# Altium schematic sheet Main.SchDoc: MAIN
size A3; Author: Marius; Engineer: Marius; Address1: ETS
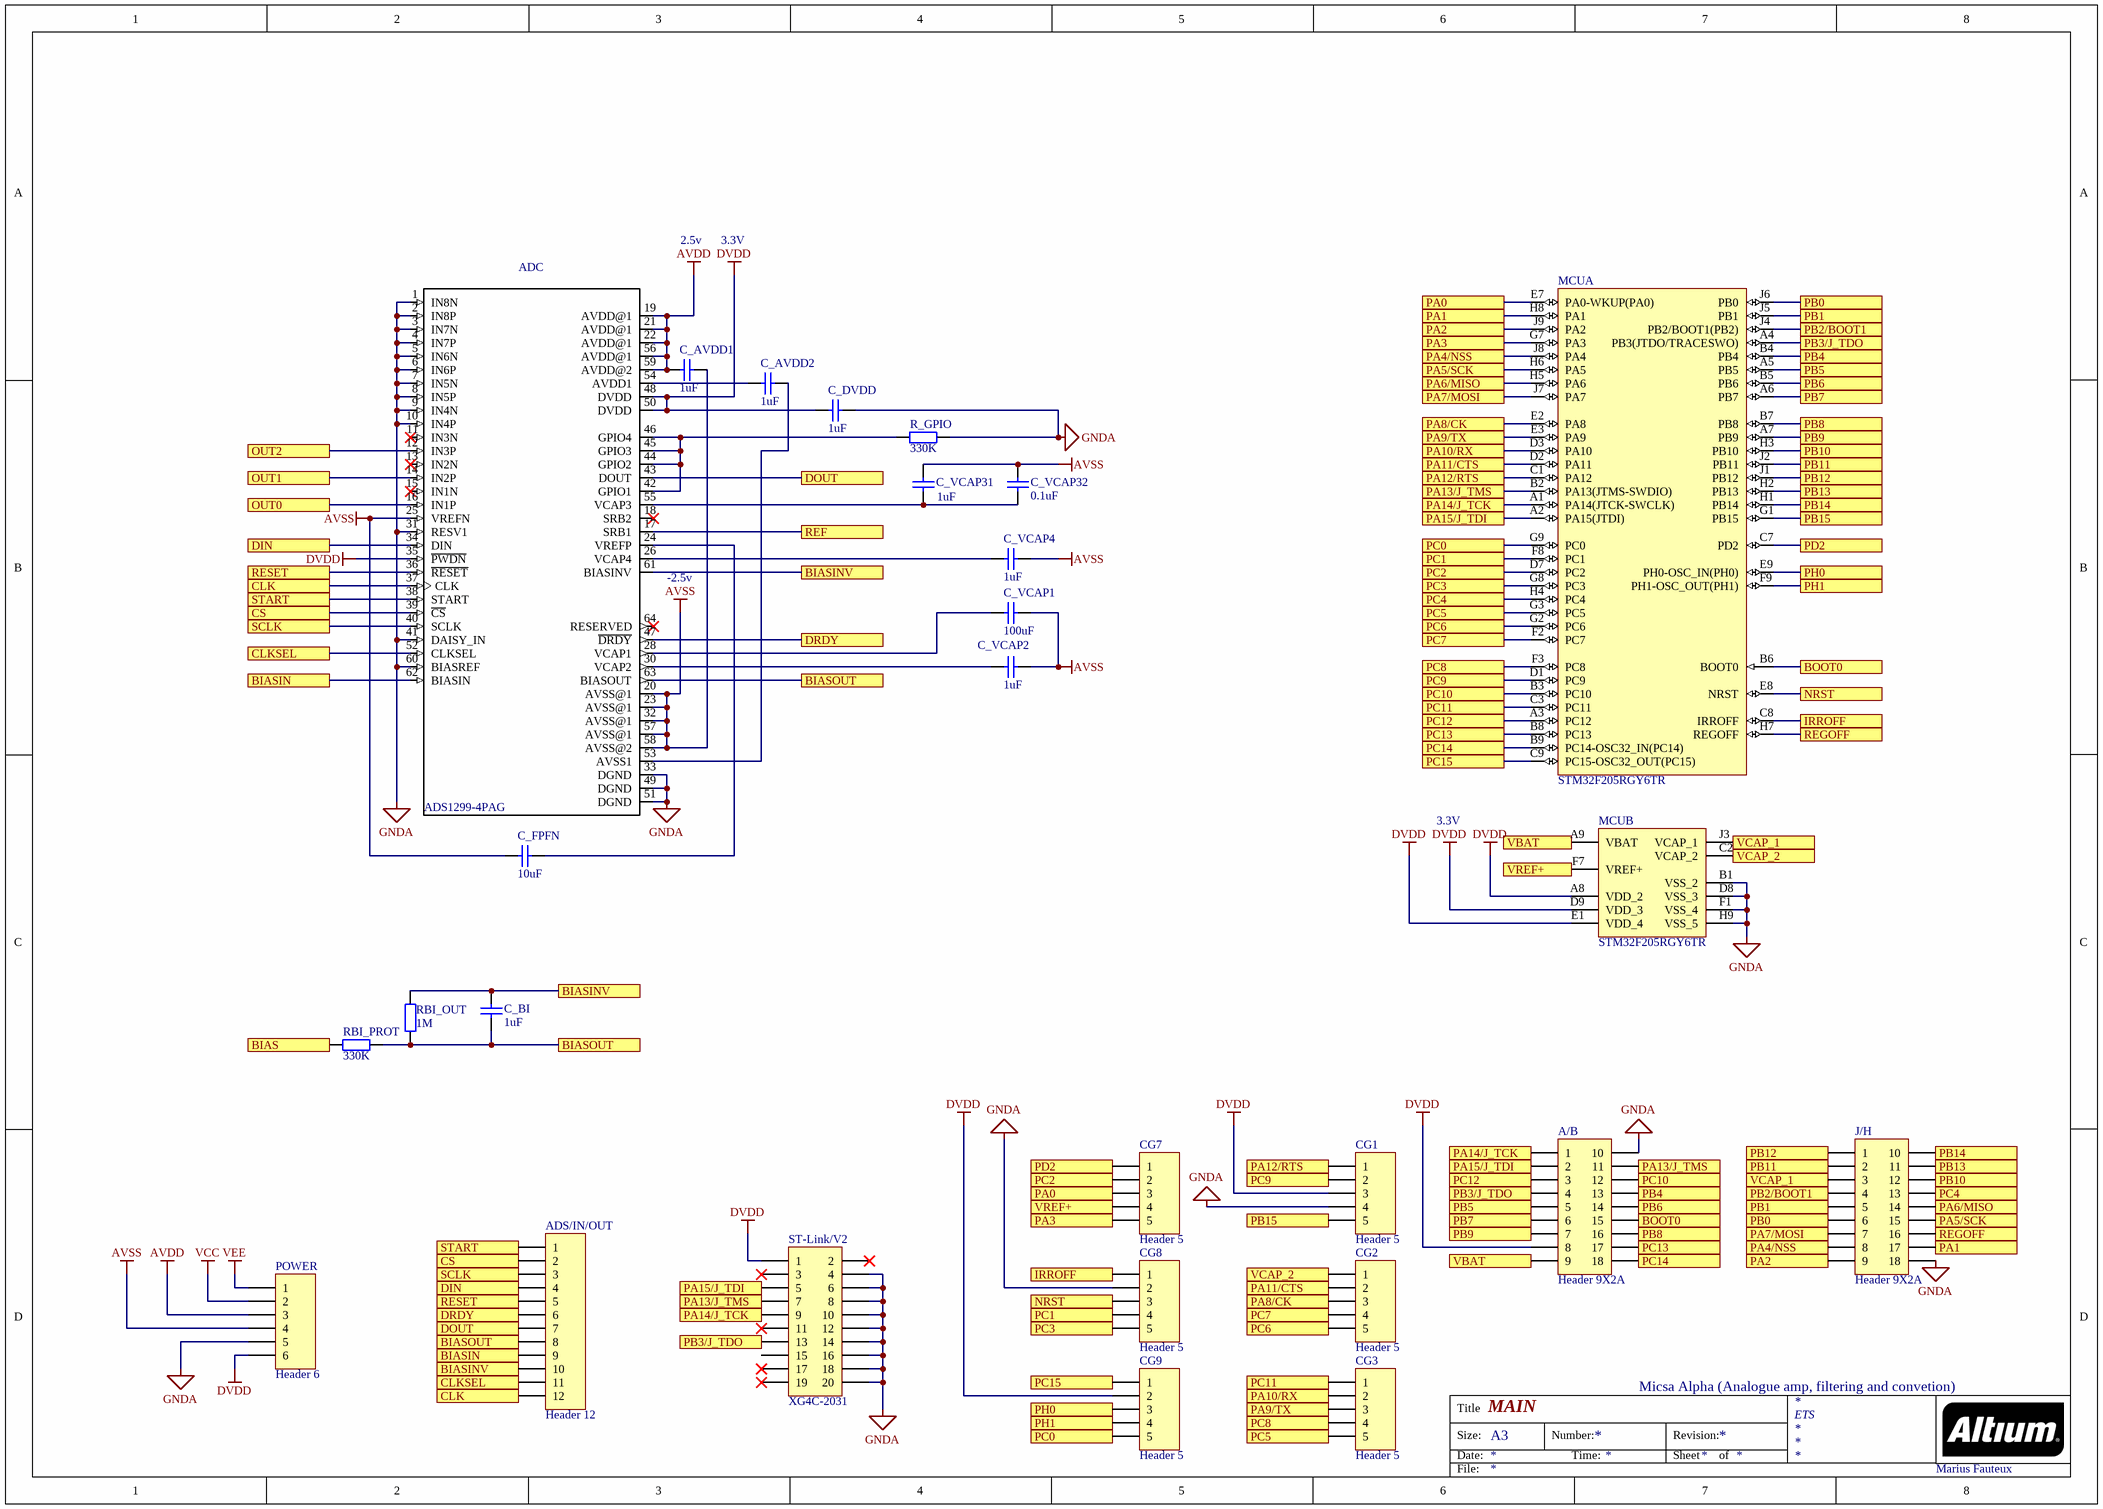
[diagram p0: Main.SchDoc]

## Parts
A/B  Header 9X2A  [HDR2X9_CEN]
ADC  ADS1299-4PAG  [QFP64P50_1200X1200X120L60X22N]
ADS/IN/OUT  Header 12  [HDR1X12]
C_AVDD1  value 1uF  [0603 (1608 Metric)]  (hidden comment: LMK107B7105KA-T)
C_AVDD2  value 1uF  [0603 (1608 Metric)]  (hidden comment: LMK107B7105KA-T)
C_BI  value 1uF  [0603 (1608 Metric)]  (hidden comment: LMK107B7105KA-T)
C_DVDD  value 1uF  [0603 (1608 Metric)]  (hidden comment: LMK107B7105KA-T)
C_FPFN  value 10uF  [1206 (3216 Metric)]  (hidden comment: C1206C106J8RACTU)
C_VCAP1  value 100uF  [1210 (3225 Metric)]  (hidden comment: JMK325BJ107MM-T)
C_VCAP2  value 1uF  [0603 (1608 Metric)]  (hidden comment: LMK107B7105KA-T)
C_VCAP4  value 1uF  [0603 (1608 Metric)]  (hidden comment: LMK107B7105KA-T)
C_VCAP31  value 1uF  [0603 (1608 Metric)]  (hidden comment: LMK107B7105KA-T)
C_VCAP32  value 0.1uF  [1206 (3216 Metric)]  (hidden comment: C1206C104F3GACTU)
CG1  Header 5  [HDR1X5]
CG2  Header 5  [HDR1X5]
CG3  Header 5  [HDR1X5]
CG7  Header 5  [HDR1X5]
CG8  Header 5  [HDR1X5]
CG9  Header 5  [HDR1X5]
J/H  Header 9X2A  [HDR2X9_CEN]
MCU  STM32F205RGY6TR  [STM-WLCSP64+2]  (parts A,B of 2)
POWER  Header 6  [HDR1X6]
R_GPIO  value 330K  [1206 (3216 Metric) RES]  (hidden comment: RT1206BRD07330KL)
RBI_OUT  value 1M  [1206 (3216 Metric) RES]  (hidden comment: RG3216P-1004-B-T1)
RBI_PROT  value 330K  [1206 (3216 Metric) RES]  (hidden comment: RT1206BRD07330KL)
ST-Link/V2  XG4C-2031  [HDR2X10]

## Ports
BIAS, BIASIN, BIASINV, BIASOUT, BOOT0, CLK, CLKSEL, CS, DIN, DOUT, DRDY, IRROFF, NRST, OUT0, OUT1, OUT2, PA0, PA1, PA2, PA3, PA4/NSS, PA5/SCK, PA6/MISO, PA7/MOSI, PA8/CK, PA9/TX, PA10/RX, PA11/CTS, PA12/RTS, PA13/J_TMS, PA14/J_TCK, PA15/J_TDI, PB0, PB1, PB2/BOOT1, PB3/J_TDO, PB4, PB5, PB6, PB7, PB8, PB9, PB10, PB11, PB12, PB13, PB14, PB15, PC0, PC1, PC2, PC3, PC4, PC5, PC6, PC7, PC8, PC9, PC10, PC11, PC12, PC13, PC14, PC15, PD2, PH0, PH1, REF, REGOFF, RESET, SCLK, START, VBAT, VCAP_1, VCAP_2, VREF+

## Nets
AVDD: ADC.19(AVDD@1) ADC.21(AVDD@1) ADC.22(AVDD@1) ADC.56(AVDD@1) ADC.59(AVDD@2) C_AVDD1.1 POWER.3
AVSS: ADC.20(AVSS@1) ADC.23(AVSS@1) ADC.25(VREFN) ADC.32(AVSS@1) ADC.57(AVSS@1) ADC.58(AVSS@2) C_AVDD1.2 C_FPFN.2 C_VCAP1.1 C_VCAP2.1 C_VCAP4.2 C_VCAP31.1 C_VCAP32.1 POWER.4
DVDD: A/B.8 ADC.35(~{PWDN}) ADC.48(DVDD) ADC.50(DVDD) C_DVDD.1 CG1.3 CG9.2 MCU.A8(VDD_2) MCU.D9(VDD_3) MCU.E1(VDD_4) POWER.6 ST-Link/V2.1
GNDA: A/B.10 ADC.1(IN8N) ADC.2(IN8P) ADC.3(IN7N) ADC.4(IN7P) ADC.5(IN6N) ADC.6(IN6P) ADC.7(IN5N) ADC.8(IN5P) ADC.9(IN4N) ADC.10(IN4P) ADC.31(RESV1) ADC.33(DGND) ADC.41(DAISY_IN) ADC.49(DGND) ADC.51(DGND) ADC.60(BIASREF) C_DVDD.2 CG1.4 CG8.2 J/H.18 MCU.B1(VSS_2) MCU.D8(VSS_3) MCU.F1(VSS_4) MCU.H9(VSS_5) POWER.5 R_GPIO.1 ST-Link/V2.4 ST-Link/V2.6 ST-Link/V2.8 ST-Link/V2.10 ST-Link/V2.12 ST-Link/V2.14 ST-Link/V2.16 ST-Link/V2.18 ST-Link/V2.20
VCC: POWER.2
VEE: POWER.1
BIAS: RBI_PROT.2 ; port BIAS
BIASIN: ADC.62(BIASIN) ADS/IN/OUT.9 ; port BIASIN
BIASINV: ADC.61(BIASINV) ADS/IN/OUT.10 C_BI.1 RBI_OUT.1 ; port BIASINV
BIASOUT: ADC.63(BIASOUT) ADS/IN/OUT.8 C_BI.2 RBI_OUT.2 RBI_PROT.1 ; port BIASOUT
BOOT0: A/B.15 MCU.B6(BOOT0) ; port BOOT0
CLK: ADC.37(CLK) ADS/IN/OUT.12 ; port CLK
CLKSEL: ADC.52(CLKSEL) ADS/IN/OUT.11 ; port CLKSEL
CS: ADC.39(~{CS}) ADS/IN/OUT.2 ; port CS
DIN: ADC.34(DIN) ADS/IN/OUT.4 ; port DIN
DOUT: ADC.43(DOUT) ADS/IN/OUT.7 ; port DOUT
DRDY: ADC.47(~{DRDY}) ADS/IN/OUT.6 ; port DRDY
IRROFF: CG8.1 MCU.C8(IRROFF) ; port IRROFF
NRST: CG8.3 MCU.E8(NRST) ; port NRST
OUT0: ADC.16(IN1P) ; port OUT0
OUT1: ADC.14(IN2P) ; port OUT1
OUT2: ADC.12(IN3P) ; port OUT2
PA0: CG7.3 MCU.E7(PA0-WKUP(PA0)) ; port PA0
PA1: J/H.17 MCU.H8(PA1) ; port PA1
PA2: J/H.9 MCU.J9(PA2) ; port PA2
PA3: CG7.5 MCU.G7(PA3) ; port PA3
PA4/NSS: J/H.8 MCU.J8(PA4) ; port PA4/NSS
PA5/SCK: J/H.15 MCU.H6(PA5) ; port PA5/SCK
PA6/MISO: J/H.14 MCU.H5(PA6) ; port PA6/MISO
PA7/MOSI: J/H.7 MCU.J7(PA7) ; port PA7/MOSI
PA8/CK: CG2.3 MCU.E2(PA8) ; port PA8/CK
PA9/TX: CG3.3 MCU.E3(PA9) ; port PA9/TX
PA10/RX: CG3.2 MCU.D3(PA10) ; port PA10/RX
PA11/CTS: CG2.2 MCU.D2(PA11) ; port PA11/CTS
PA12/RTS: CG1.1 MCU.C1(PA12) ; port PA12/RTS
PA13/J_TMS: A/B.11 MCU.B2(PA13(JTMS-SWDIO)) ST-Link/V2.7 ; port PA13/J_TMS
PA14/J_TCK: A/B.1 MCU.A1(PA14(JTCK-SWCLK)) ST-Link/V2.9 ; port PA14/J_TCK
PA15/J_TDI: A/B.2 MCU.A2(PA15(JTDI)) ST-Link/V2.5 ; port PA15/J_TDI
PB0: J/H.6 MCU.J6(PB0) ; port PB0
PB1: J/H.5 MCU.J5(PB1) ; port PB1
PB2/BOOT1: J/H.4 MCU.J4(PB2/BOOT1(PB2)) ; port PB2/BOOT1
PB3/J_TDO: A/B.4 MCU.A4(PB3(JTDO/TRACESWO)) ST-Link/V2.13 ; port PB3/J_TDO
PB4: A/B.13 MCU.B4(PB4) ; port PB4
PB5: A/B.5 MCU.A5(PB5) ; port PB5
PB6: A/B.14 MCU.B5(PB6) ; port PB6
PB7: A/B.6 MCU.A6(PB7) ; port PB7
PB8: A/B.16 MCU.B7(PB8) ; port PB8
PB9: A/B.7 MCU.A7(PB9) ; port PB9
PB10: J/H.12 MCU.H3(PB10) ; port PB10
PB11: J/H.2 MCU.J2(PB11) ; port PB11
PB12: J/H.1 MCU.J1(PB12) ; port PB12
PB13: J/H.11 MCU.H2(PB13) ; port PB13
PB14: J/H.10 MCU.H1(PB14) ; port PB14
PB15: CG1.5 MCU.G1(PB15) ; port PB15
PC0: CG9.5 MCU.G9(PC0) ; port PC0
PC1: CG8.4 MCU.F8(PC1) ; port PC1
PC2: CG7.2 MCU.D7(PC2) ; port PC2
PC3: CG8.5 MCU.G8(PC3) ; port PC3
PC4: J/H.13 MCU.H4(PC4) ; port PC4
PC5: CG3.5 MCU.G3(PC5) ; port PC5
PC6: CG2.5 MCU.G2(PC6) ; port PC6
PC7: CG2.4 MCU.F2(PC7) ; port PC7
PC8: CG3.4 MCU.F3(PC8) ; port PC8
PC9: CG1.2 MCU.D1(PC9) ; port PC9
PC10: A/B.12 MCU.B3(PC10) ; port PC10
PC11: CG3.1 MCU.C3(PC11) ; port PC11
PC12: A/B.3 MCU.A3(PC12) ; port PC12
PC13: A/B.17 MCU.B8(PC13) ; port PC13
PC14: A/B.18 MCU.B9(PC14-OSC32_IN(PC14)) ; port PC14
PC15: CG9.1 MCU.C9(PC15-OSC32_OUT(PC15)) ; port PC15
PD2: CG7.1 MCU.C7(PD2) ; port PD2
PH0: CG9.3 MCU.E9(PH0-OSC_IN(PH0)) ; port PH0
PH1: CG9.4 MCU.F9(PH1-OSC_OUT(PH1)) ; port PH1
REF: ADC.17(SRB1) ; port REF
REGOFF: J/H.16 MCU.H7(REGOFF) ; port REGOFF
RESET: ADC.36(~{RESET}) ADS/IN/OUT.5 ; port RESET
SCLK: ADC.40(SCLK) ADS/IN/OUT.3 ; port SCLK
START: ADC.38(START) ADS/IN/OUT.1 ; port START
VBAT: A/B.9 MCU.A9(VBAT) ; port VBAT
VCAP_1: J/H.3 MCU.J3(VCAP_1) ; port VCAP_1
VCAP_2: CG2.1 MCU.C2(VCAP_2) ; port VCAP_2
VREF+: CG7.4 MCU.F7(VREF+) ; port VREF+
NetADC_24: ADC.24(VREFP) C_FPFN.1
NetADC_26: ADC.26(VCAP4) C_VCAP4.1
NetADC_28: ADC.28(VCAP1) C_VCAP1.2
NetADC_30: ADC.30(VCAP2) C_VCAP2.2
NetADC_42: ADC.42(GPIO1) ADC.44(GPIO2) ADC.45(GPIO3) ADC.46(GPIO4) R_GPIO.2
NetADC_53: ADC.53(AVSS1) C_AVDD2.2
NetADC_54: ADC.54(AVDD1) C_AVDD2.1
NetADC_55: ADC.55(VCAP3) C_VCAP31.2 C_VCAP32.2

Not connected (* = marked no-connect by the designer): ADC 11(IN3N)* 13(IN2N)* 15(IN1N)* 18(SRB2)* 64(RESERVED)*; ST-Link/V2 2* 3* 11* 15 17* 19*

## Notes on the sheet
- 2.5v
- 3.3V
- (near ADC) -2.5v
- Micsa Alpha (Analogue amp, filtering and convetion)
- Marius Fauteux
- Title
- Size:
- Date:
- A3
- Number:
- Time:
- Revision:
- Sheet
- of
- File:

## Library data of the parts
A/B J/H = Header 9X2A: Header, 9-Pin, Dual row; LatestRevisionDate: 17-Jul-2002; LatestRevisionNote: Re-released for DXP Platform.; Publisher: Altium Limited
ADC = ADS1299-4PAG: IC AFE 4-CH 24BIT 64TQFP; MF: Texas Instruments; Availability: Good; Price: 27.58 USD; Package: TQFP-64 Texas Instruments; MP: ADS1299-4PAG; Value: *
ADS/IN/OUT = Header 12: Header, 12-Pin; LatestRevisionDate: 17-Jul-2002; LatestRevisionNote: Re-released for DXP Platform.; Publisher: Altium Limited
C_AVDD1 C_AVDD2 C_BI C_DVDD C_VCAP2 C_VCAP4 C_VCAP31 = Cap: 1µF ±10% 10V Ceramic Capacitor X7R 0603 (1608 Metric); Published: 8-Jun-2000; LatestRevisionDate: 17-Jul-2002; LatestRevisionNote: Re-released for DXP Platform.; Publisher: Altium Limited
  C_AVDD1 C_AVDD2 C_DVDD C_VCAP2 C_VCAP4 C_VCAP31: PackageReference: 0603 (1608 Metric); PackageDescription: Surface Mount, MLCC
  C_BI: PackageDescription: 0603 (1608 Metric)
C_FPFN = Cap: 10µF ±5% 10V Ceramic Capacitor X7R 1206 (3216 Metric); Published: 8-Jun-2000; LatestRevisionDate: 17-Jul-2002; LatestRevisionNote: Re-released for DXP Platform.; PackageReference: 1206 (3216 Metric); Publisher: Altium Limited; PackageDescription: CAP CER 10UF 10V X7R 1206
C_VCAP1 = Cap: 100µF ±20% 6.3V Ceramic Capacitor X5R 1210 (3225 Metric); Published: 8-Jun-2000; LatestRevisionDate: 17-Jul-2002; LatestRevisionNote: Re-released for DXP Platform.; PackageReference: MK325; Publisher: Altium Limited; PackageDescription: 1210 (3225 Metric)
C_VCAP32 = Cap: 0.1µF ±1% 25V Ceramic Capacitor C0G, NP0 1206 (3216 Metric); Published: 8-Jun-2000; LatestRevisionDate: 17-Jul-2002; LatestRevisionNote: Re-released for DXP Platform.; PackageReference: 1206 (3216 Metric); Publisher: Altium Limited; PackageDescription: CAP CER 0.1UF 25V C0G/NP0 1206
CG1-CG3 CG7-CG9 = Header 5: Header, 5-Pin; LatestRevisionDate: 17-Jul-2002; LatestRevisionNote: Re-released for DXP Platform.; Publisher: Altium Limited
MCU = STM32F205RGY6TR: ARM Cortex-M3 32-bit MCU, 1024 KB Flash, 128 KB Internal RAM, 51 I/Os, 66-pin WLCSP, -40 to 85 degC, Tape and Reel; D/A Converter: 2x12-bit (2 Channel); FLASH Size (Prog) (kB): 1024; I/Os (High Current): 51; Internal RAM Size (kB): 128; Operating Frequency(F) (Processor speed) (MHz): 120; Supply Voltage(Vcc) min (V): 1.8; DatasheetVersion: Rev. 9; PackageVersion: Rev. 10, 10/2012; PackageReference: WLCSP64+2; PackageDescription: 64+2-Ball Wafer Level Chip Size package, 3.639 x 3.971 mm Body, 0.4 mm Pitch; Supplier 1: Digi-Key; Supplier Part Number 1: 497-13338-2-ND; Supplier 2: Digi-Key; Supplier Part Number 2: 497-13338-1-ND; Supplier 3: Digi-Key; Supplier Part Number 3: 497-13338-6-ND; Supplier 4: Newark; Supplier Part Number 4: 99W9826; Supplier 5: Newark; Supplier Part Number 5: 73T2317; Core: ARM Cortex-M3; Packing: Tape and Reel; Mounting Technology: Surface Mount; PartNumber: STM32F205RGY6TR; ComponentLink1Description: Manufacturer URL; ComponentLink1URL: http://www.st.com/web/en/home.html; ComponentLink2Description: Datasheet; ComponentLink2URL: http://www.st.com/st-web-ui/static/active/en/resource/technical/document/datasheet/CD00237391.pdf; ComponentLink3Description: Package Specification; ComponentLink3URL: http://www.st.com/st-web-ui/static/active/en/resource/technical/document/datasheet/CD00237391.pdf
POWER = Header 6: Header, 6-Pin; LatestRevisionDate: 17-Jul-2002; LatestRevisionNote: Re-released for DXP Platform.; Publisher: Altium Limited
R_GPIO RBI_PROT = Res2: 330 kOhms ±0.1% 0.25W, 1/4W Chip Resistor 1206 (3216 Metric) Moisture Resistant Thin Film; Published: 8-Jun-2000; LatestRevisionDate: 17-Jul-2002; LatestRevisionNote: Re-released for DXP Platform.; PackageReference: 1206 (3216 Metric); Publisher: Altium Limited; PackageDescription: RES SMD 330K OHM 0.1% 1/4W 1206
RBI_OUT = Res2: 1 MOhms ±0.1% 0.25W, 1/4W Chip Resistor 1206 (3216 Metric) Anti-Sulfur, Automotive AEC-Q200 Thin Film; Published: 8-Jun-2000; LatestRevisionDate: 17-Jul-2002; LatestRevisionNote: Re-released for DXP Platform.; PackageReference: 1206 (3216 Metric); Publisher: Altium Limited; PackageDescription: RES SMD 1M OHM 0.1% 1/4W 1206
ST-Link/V2 = Header 10X2: Header, 10-Pin, Dual row; LatestRevisionDate: 17-Jul-2002; LatestRevisionNote: Re-released for DXP Platform.; Publisher: Altium Limited